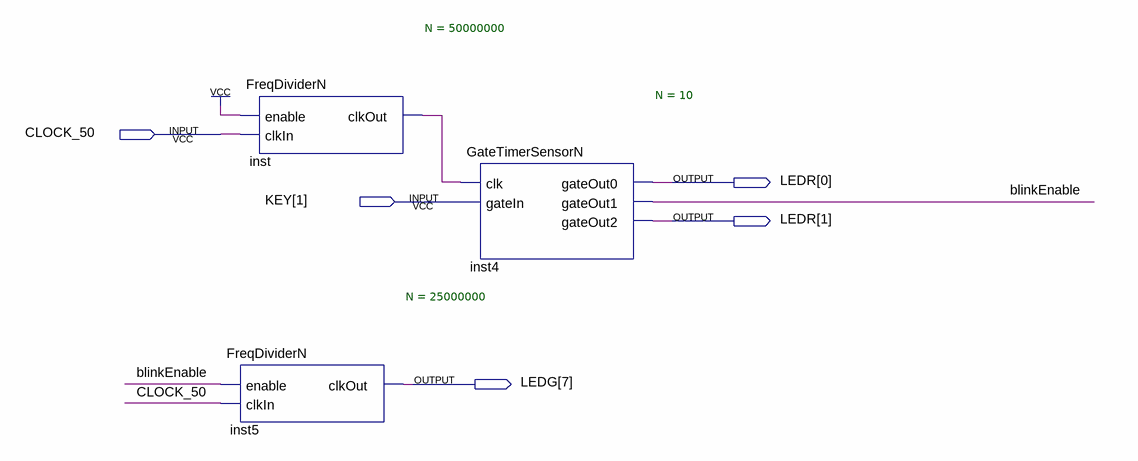
[diagram p0: schematic sheet]
// Quartus schematic ParkGateSensor_Demo.bdf as structural Verilog: 3 symbols, 5 pins
module ParkGateSensor_Demo (
  input  CLOCK_50,
  input  [1:1] KEY,
  output [1:0] LEDR,
  output [7:7] LEDG
);

  wire blinkEnable, inst_clkout;

  FreqDividerN #(.N(25000000)) inst5 (.enable(blinkEnable), .clkIn(CLOCK_50), .clkOut(LEDG[7]));
  FreqDividerN #(.N(50000000)) inst (.enable(1'b1), .clkIn(CLOCK_50), .clkOut(inst_clkout));
  GateTimerSensorN #(.N(10)) inst4 (
    .clk(inst_clkout), .gateIn(KEY[1]), .gateOut0(LEDR[0]), .gateOut1(blinkEnable), .gateOut2(LEDR[1]));
endmodule
